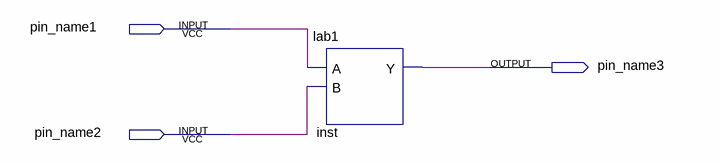
[diagram p0: schematic sheet]
// Quartus schematic Block2.bdf as structural Verilog: 1 symbols, 3 pins
module Block2 (
  input  pin_name1,
  input  pin_name2,
  output pin_name3
);

  lab1 inst (.A(pin_name1), .B(pin_name2), .Y(pin_name3));
endmodule
